# Altium project NSTTC.PrjPCB
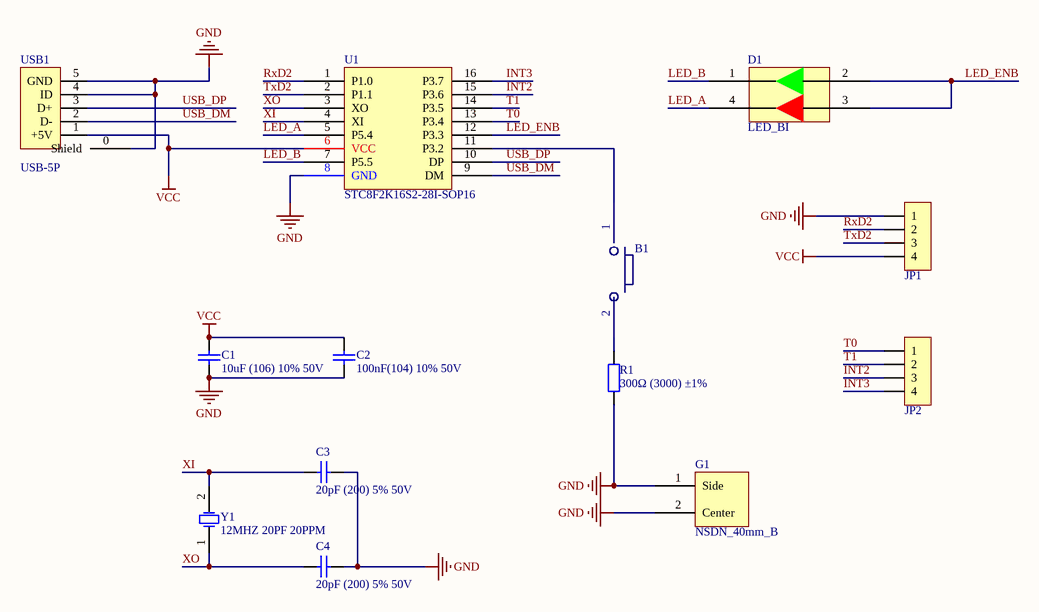
[diagram p0: NSTTC.SchDoc]
1 sheet, 13 parts. Net scope: global (net labels, ports and power ports of the same name join across sheets).
Board file: NSTTC.PcbDoc

## Sheet NSTTC.SchDoc
size A4

### Parts
B1  USB_CTL  [MetalButton]  (value not drawn)
C1  10uF (106) 10% 50V  [1206_C]
C2  100nF(104) 10% 50V  [0805_C]
C3  20pF (200) 5% 50V  [0805_C]
C4  20pF (200) 5% 50V  [0805_C]
D1  LED_BI  [LED_BI]
G1  NSDN_40mm_B  [NSDN_40mm_B]
JP1  HDR-1X4  [HDR2.54-WS-4P]  (value not drawn)
JP2  HDR-1X4  [HDR2.54-WS-4P]  (value not drawn)
R1  300Ω (3000) ±1%  [0805_R]
U1  STC8F2K16S2-28I-SOP16  [SOP16]
USB1  USB-5P  [USB-MICRO_D]
Y1  12MHZ 20PF 20PPM  [SMD-5032_2P]

### Nets
GND: C1.2 C2.2 C3.2 C4.1 G1.1(Side) G1.2(Center) JP1.1 R1.1 U1.8(GND) USB1.0(Shield) USB1.4(ID) USB1.5(GND)
VCC: C1.1 C2.1 JP1.4 U1.6(VCC) USB1.1(+5V)
INT2: JP2.3 U1.15(P3.6)
INT3: JP2.4 U1.16(P3.7)
LED_A: D1.4 U1.5(P5.4)
LED_B: D1.1 U1.7(P5.5)
LED_ENB: D1.2 D1.3 U1.12(P3.3)
RxD2: JP1.2 U1.1(P1.0)
T0: JP2.1 U1.13(P3.4)
T1: JP2.2 U1.14(P3.5)
TxD2: JP1.3 U1.2(P1.1)
USB_DM: U1.9(DM) USB1.2(D-)
USB_DP: U1.10(DP) USB1.3(D+)
XI: C3.1 U1.4(XI) Y1.2(OSC2)
XO: C4.2 U1.3(XO) Y1.1(OSC1)
NetB1_1: B1.1 U1.11(P3.2)
NetB1_2: B1.2 R1.2

### Library data of the parts
B1 = MetalButton
C1 = 1206 10uF (106) 10% 50V: 贴片电容; ComponentLink1Description: 供应商链接; ComponentLink1URL: http://www.szlcsc.com/product/details_14236.html; Package: 1206; Supplier: LC; SuppliersPartNumber: C13585
C2 = 0805 100nF(104) 10% 50V: 贴片电容; ComponentLink1Description: 供应商链接; ComponentLink1URL: http://www.szlcsc.com/product/details_50686.html; Package: 0805; Supplier: LC; SuppliersPartNumber: C49678
C3 C4 = 0805 20pF (200) 5% 50V: 贴片电容; ComponentLink1Description: 供应商链接; ComponentLink1URL: http://www.szlcsc.com/product/details_2150.html; Package: 0805; Supplier: LC; SuppliersPartNumber: C1798
JP1 JP2 = Header 4: 4P接插件; 版权归属: 源创客; BOM名称: 4P接插件; 学习资源: www.ooocke.com
R1 = 0805 300Ω (3000) 1%: 贴片电阻; ComponentLink1Description: 供应商链接; ComponentLink1URL: http://www.szlcsc.com/product/details_18305.html; Package: 0805; Supplier: LC; SuppliersPartNumber: C17617
USB1 = USB-5P: 微型USB母座; 版权归属: 源创客; BOM名称: 微型USB母座; 学习资源: www.ooocke.com
Y1 = SMD-5032_2P 11.0592MHZ 20PF 20PPM: 贴片晶振; ComponentLink1Description: 供应商链接; ComponentLink1URL: http://www.szlcsc.com/product/details_53039.html; Package: SMD-5032_2P; Supplier: LC; SuppliersPartNumber: C52026